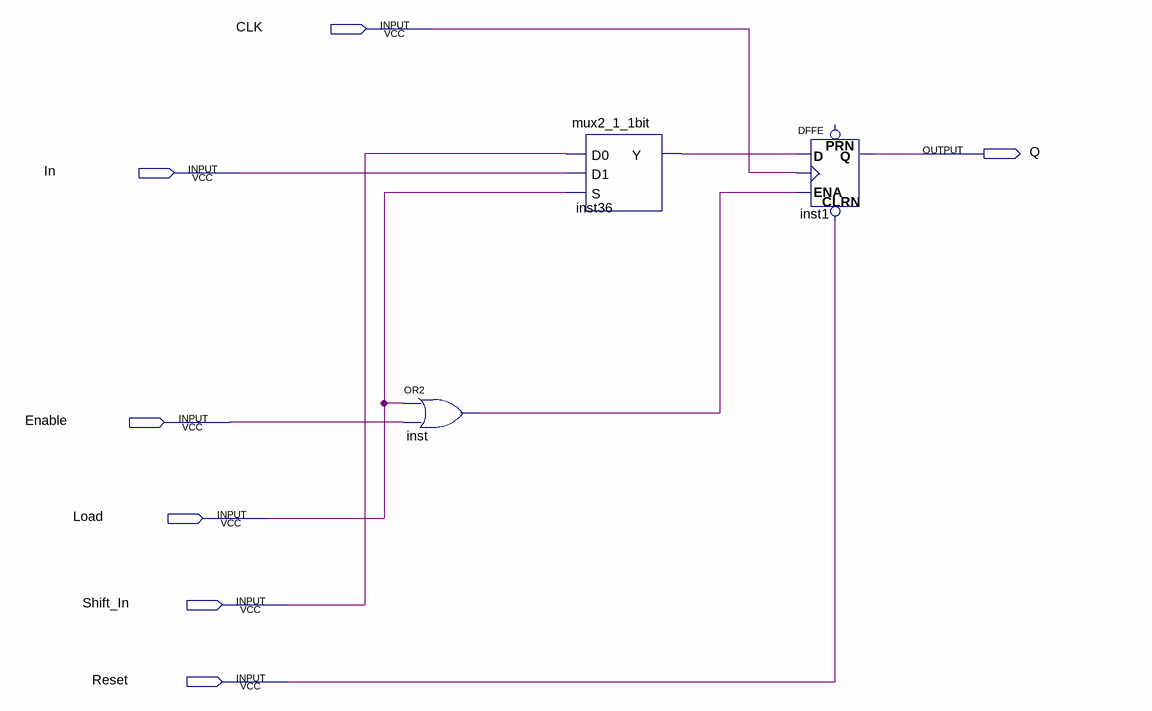
[diagram p0: schematic sheet]
// Quartus schematic RC.bdf as structural Verilog: 3 symbols, 7 pins
module RC (
  input  CLK,
  input  In,
  input  Enable,
  input  Load,
  input  Shift_In,
  input  Reset,
  output Q
);

  wire inst36_y, inst_out;

  or inst (inst_out, Load, Enable);
  mux2_1_1bit inst36 (.D0(Shift_In), .D1(In), .S(Load), .Y(inst36_y));
  DFFE inst1 (.CLRN(Reset), .D(inst36_y), .CLK(CLK), .ENA(inst_out), .Q(Q));  // open: PRN
endmodule
